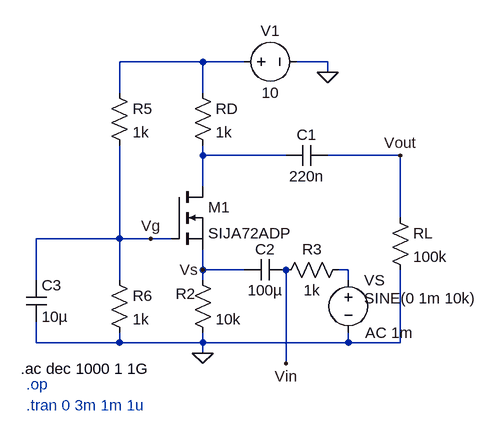
[diagram p0: schematic mosfet_cg.asc]
mosfet_cg.asc, the LTspice schematic file:
Version 4.1
SHEET 1 880 680
WIRE 192 -64 64 -64
WIRE 256 -64 192 -64
WIRE 384 -64 336 -64
WIRE 384 -48 384 -64
WIRE 64 -16 64 -64
WIRE 192 -16 192 -64
WIRE 192 80 192 64
WIRE 320 80 192 80
WIRE 496 80 384 80
WIRE 192 128 192 80
WIRE 496 176 496 80
WIRE 64 208 64 64
WIRE 64 208 -64 208
WIRE 112 208 64 208
WIRE 144 208 112 208
WIRE 192 256 192 224
WIRE 256 256 192 256
WIRE 416 256 400 256
WIRE -64 272 -64 208
WIRE 64 272 64 208
WIRE 192 272 192 256
WIRE 416 272 416 256
WIRE -64 368 -64 336
WIRE 64 368 64 352
WIRE 64 368 -64 368
WIRE 192 368 192 352
WIRE 192 368 64 368
WIRE 416 368 416 352
WIRE 416 368 192 368
WIRE 496 368 496 256
WIRE 496 368 416 368
WIRE 192 384 192 368
WIRE 320 400 320 256
FLAG 192 384 0
FLAG 384 -48 0
FLAG 496 80 Vout
FLAG 320 400 Vin
FLAG 112 208 Vg
FLAG 192 256 Vs
SYMBOL nmos 144 128 R0
SYMATTR InstName M1
SYMATTR Value SIJA72ADP
SYMBOL cap 384 64 R90
WINDOW 0 0 32 VBottom 2
WINDOW 3 32 32 VTop 2
SYMATTR InstName C1
SYMATTR Value 220n
SYMBOL res 480 160 R0
SYMATTR InstName RL
SYMATTR Value 100k
SYMBOL res 176 256 R0
WINDOW 0 -26 37 Left 2
SYMATTR InstName R2
SYMATTR Value 10k
SYMBOL cap 320 240 R90
WINDOW 0 0 32 VBottom 2
WINDOW 3 32 32 VTop 2
SYMATTR InstName C2
SYMATTR Value 100µ
SYMBOL res 416 240 R90
WINDOW 0 0 56 VBottom 2
WINDOW 3 32 56 VTop 2
SYMATTR InstName R3
SYMATTR Value 1k
SYMBOL voltage 416 256 R0
WINDOW 123 26 97 Left 2
WINDOW 39 0 0 Left 0
WINDOW 3 24 44 Left 2
SYMATTR Value2 AC 1m
SYMATTR Value SINE(0 1m 10k)
SYMATTR InstName VS
SYMBOL res 176 -32 R0
SYMATTR InstName RD
SYMATTR Value 1k
SYMBOL res 48 -32 R0
SYMATTR InstName R5
SYMATTR Value 1k
SYMBOL voltage 240 -64 R270
WINDOW 0 32 56 VTop 2
WINDOW 3 -32 56 VBottom 2
WINDOW 123 0 0 Left 0
WINDOW 39 0 0 Left 0
SYMATTR InstName V1
SYMATTR Value 10
SYMBOL res 48 256 R0
SYMATTR InstName R6
SYMATTR Value 1k
SYMBOL cap -80 272 R0
SYMATTR InstName C3
SYMATTR Value 10µ
TEXT -88 408 Left 2 !.ac dec 1000 1 1G
TEXT -80 432 Left 2 ;.op
TEXT -80 464 Left 2 ;.tran 0 3m 1m 1u

The netlist it stands for:
* mosfet_cg.asc
M1 N002 Vg Vs Vs SIJA72ADP
C1 Vout N002 220n
RL Vout 0 100k
R2 Vs 0 10k
C2 Vin Vs 100µ
R3 N003 Vin 1k
VS N003 0 SINE(0 1m 10k) AC 1m
RD N001 N002 1k
R5 N001 Vg 1k
V1 N001 0 10
R6 Vg 0 1k
C3 Vg 0 10µ
.model NMOS NMOS
.model PMOS PMOS
.lib standard.mos
.ac dec 1000 1 1G
* .op
* .tran 0 3m 1m 1u
.backanno
.end